# EAGLE schematic pots_mcu (EAGLE 6.2)
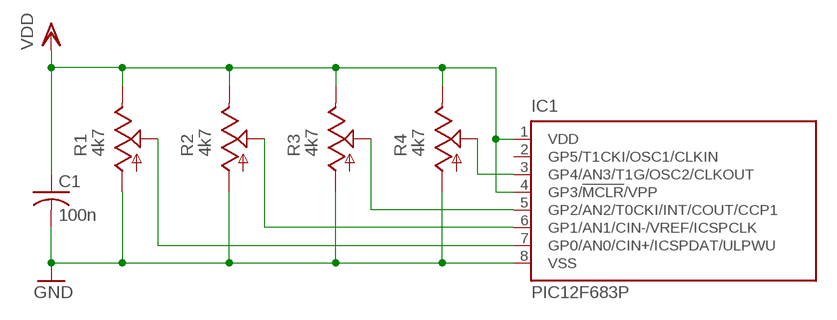
[diagram p0: schematic, sheet 1]

## Parts
C1  100n  C-US025-025X050  [C025-025X050]
IC1  PIC12F683P  [DIL8]
R1  4k7  US-EVUE2A  [EVUE]
R2  4k7  US-EVUE2A  [EVUE]
R3  4k7  US-EVUE2A  [EVUE]
R4  4k7  US-EVUE2A  [EVUE]

## Nets
GND: C1.2 IC1.8(VSS) R1.1(A) R2.1(A) R3.1(A) R4.1(A)
N$1: IC1.7(GP0/AN0/CIN+/ICSPDAT/ULPWU) R1.2(S)
N$2: IC1.6(GP1/AN1/CIN-/VREF/ICSPCLK) R2.2(S)
N$3: IC1.5(GP2/AN2/T0CKI/INT/COUT/CCP1) R3.2(S)
N$4: IC1.3(GP4/AN3/T1G/OSC2/CLKOUT) R4.2(S)
VDD: C1.1 IC1.1(VDD) IC1.4(GP3/!MCLR!/VPP) R1.3(E) R2.3(E) R3.3(E) R4.3(E)
Unconnected: IC1.2(GP5/T1CKI/OSC1/CLKIN)

## Library data of the parts
C1 = rcl:C-US: CAPACITOR, American symbol
IC1 = microchip:PIC12F683: 8-Pin Flash-Based, 8-Bit CMOS Microcontrollers with nanoWatt Technology Source: http://ww1.microchip.com/downloads/en/DeviceDoc/41211D_.pdf; MF: MICROCHIP; MPN: PIC12F683-I/P; OC_FARNELL: 9759034; OC_NEWARK: 89H0442
R1-R4 = pot:US-EVU: 9 mm Square Rotary Potentiometers Source: Panasonic